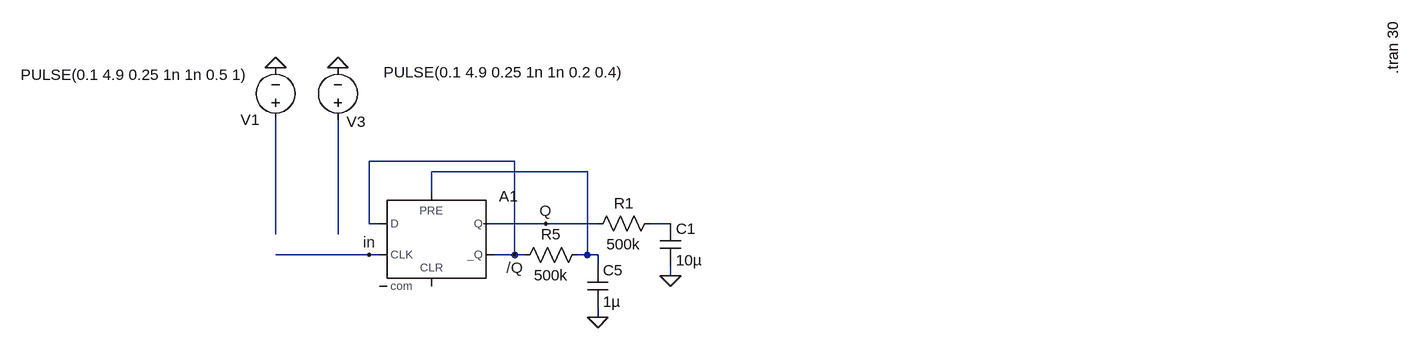
[diagram p0: schematic DAC.asc]
DAC.asc, the LTspice schematic file:
Version 4
SHEET 1 1960 680
WIRE 528 -16 304 -16
WIRE 640 0 400 0
WIRE 400 32 400 0
WIRE 304 80 304 -16
WIRE 320 80 304 80
WIRE 576 80 480 80
WIRE 656 80 576 80
WIRE 768 80 736 80
WIRE 160 96 160 -80
WIRE 256 96 256 -80
WIRE 304 128 160 128
WIRE 320 128 304 128
WIRE 528 128 528 -16
WIRE 528 128 496 128
WIRE 544 128 528 128
WIRE 640 128 640 0
WIRE 640 128 624 128
WIRE 656 128 640 128
WIRE 656 144 656 128
WIRE 768 160 768 144
WIRE 656 224 656 208
FLAG 256 -160 0
FLAG 576 80 Q
FLAG 528 128 /Q
FLAG 304 128 in
FLAG 656 224 0
FLAG 768 160 0
FLAG 160 -160 0
SYMBOL Digital\\dflop 400 32 R0
SYMATTR InstName A1
SYMATTR SpiceLine Vhigh 5 Trise 10n
SYMBOL voltage 256 -64 R180
WINDOW 123 0 0 Left 0
WINDOW 39 0 0 Left 0
WINDOW 3 -442 89 Left 2
WINDOW 0 -43 13 Left 2
SYMATTR Value PULSE(0.1 4.9 0.25 1n 1n 0.2 0.4)
SYMATTR InstName V3
SYMBOL res 640 112 R90
WINDOW 0 0 56 VBottom 2
WINDOW 3 32 56 VTop 2
SYMATTR InstName R5
SYMATTR Value 500k
SYMBOL cap 640 144 R0
SYMATTR InstName C5
SYMATTR Value 1µ
SYMBOL voltage 160 -64 R180
WINDOW 123 0 0 Left 0
WINDOW 39 0 0 Left 0
WINDOW 3 41 85 Left 2
SYMATTR Value PULSE(0.1 4.9 0.25 1n 1n 0.5 1)
SYMATTR InstName V1
SYMBOL res 752 64 R90
WINDOW 0 0 56 VBottom 2
WINDOW 3 32 56 VTop 2
SYMATTR InstName R1
SYMATTR Value 500k
SYMBOL cap 752 80 R0
SYMATTR InstName C1
SYMATTR Value 10µ
TEXT 1880 -232 VRight 2 !.tran 30

The netlist it stands for:
* DAC.asc
A1 /Q 0 in N001 0 /Q Q 0 DFLOP Vhigh 5 Trise 10n
V3 N004 0 PULSE(0.1 4.9 0.25 1n 1n 0.2 0.4)
R5 N001 /Q 500k
C5 N001 0 1µ
V1 N003 0 PULSE(0.1 4.9 0.25 1n 1n 0.5 1)
R1 N002 Q 500k
C1 N002 0 10µ
.tran 30
.backanno
.end